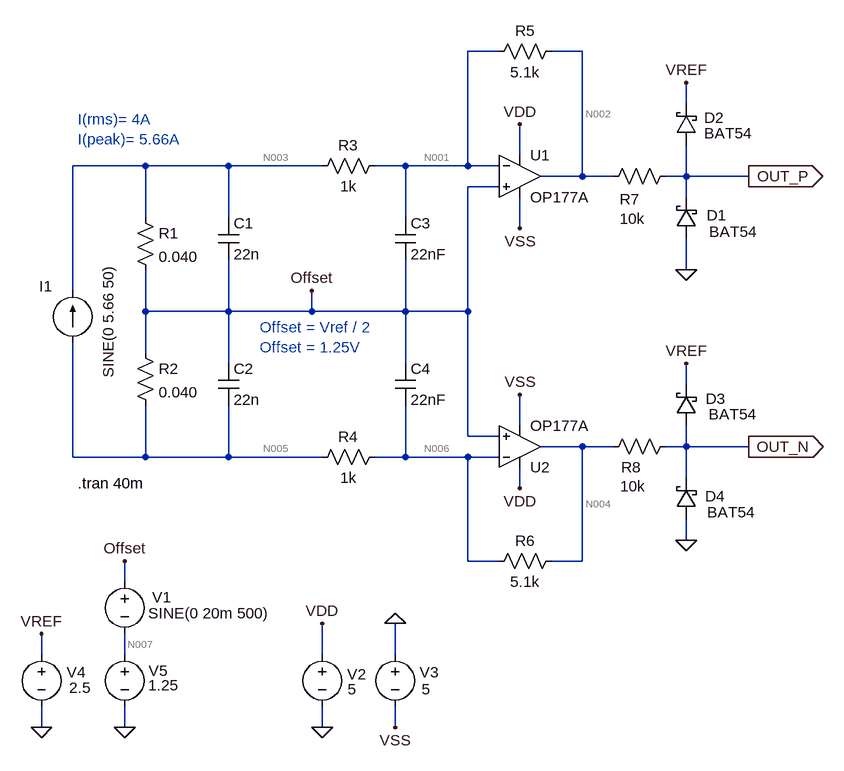
[diagram p0: schematic v1.1.asc]
v1.1.asc, the LTspice schematic file:
Version 4.1
SHEET 1 1828 1004
WIRE 800 -208 752 -208
WIRE 928 -208 880 -208
WIRE 1088 -128 1088 -160
WIRE 832 -48 832 -96
WIRE 256 -32 144 -32
WIRE 384 -32 256 -32
WIRE 528 -32 384 -32
WIRE 656 -32 608 -32
WIRE 752 -32 752 -208
WIRE 752 -32 656 -32
WIRE 800 -32 752 -32
WIRE 928 -16 928 -208
WIRE 928 -16 864 -16
WIRE 976 -16 928 -16
WIRE 1088 -16 1088 -64
WIRE 1088 -16 1056 -16
WIRE 1184 -16 1088 -16
WIRE 800 0 752 0
WIRE 1088 16 1088 -16
WIRE 256 48 256 -32
WIRE 384 48 384 -32
WIRE 656 48 656 -32
WIRE 832 64 832 16
WIRE 1088 128 1088 80
WIRE 144 160 144 -32
WIRE 256 192 256 128
WIRE 384 192 384 112
WIRE 384 192 256 192
WIRE 512 192 512 160
WIRE 512 192 384 192
WIRE 656 192 656 112
WIRE 656 192 512 192
WIRE 752 192 752 0
WIRE 752 192 656 192
WIRE 256 256 256 192
WIRE 384 272 384 192
WIRE 656 272 656 192
WIRE 1088 304 1088 272
WIRE 832 368 832 320
WIRE 752 384 752 192
WIRE 800 384 752 384
WIRE 928 400 864 400
WIRE 976 400 928 400
WIRE 1088 400 1088 368
WIRE 1088 400 1056 400
WIRE 1184 400 1088 400
WIRE 144 416 144 240
WIRE 256 416 256 336
WIRE 256 416 144 416
WIRE 384 416 384 336
WIRE 384 416 256 416
WIRE 528 416 384 416
WIRE 656 416 656 336
WIRE 656 416 608 416
WIRE 752 416 656 416
WIRE 800 416 752 416
WIRE 1088 448 1088 400
WIRE 832 464 832 432
WIRE 1088 544 1088 512
WIRE 752 576 752 416
WIRE 800 576 752 576
WIRE 928 576 928 400
WIRE 928 576 880 576
WIRE 224 608 224 576
WIRE 96 720 96 688
WIRE 224 720 224 688
WIRE 528 720 528 672
WIRE 640 720 640 672
WIRE 96 832 96 800
WIRE 224 832 224 800
WIRE 528 832 528 800
WIRE 640 832 640 800
FLAG 1184 -16 OUT_P
IOPIN 1184 -16 Out
FLAG 1184 400 OUT_N
IOPIN 1184 400 Out
FLAG 528 832 0
FLAG 528 672 VDD
FLAG 832 -96 VDD
FLAG 832 464 VDD
FLAG 640 832 VSS
FLAG 832 64 VSS
FLAG 832 320 VSS
FLAG 1088 544 0
FLAG 1088 128 0
FLAG 96 832 0
FLAG 96 688 VREF
FLAG 224 832 0
FLAG 224 576 Offset
FLAG 512 160 Offset
FLAG 1088 -160 VREF
FLAG 1088 272 VREF
FLAG 640 672 0
SYMBOL current 144 240 R180
WINDOW 0 31 87 Left 2
WINDOW 3 -55 -54 VRight 2
WINDOW 123 0 0 Left 0
WINDOW 39 0 0 Left 0
SYMATTR InstName I1
SYMATTR Value SINE(0 5.66 50)
SYMBOL res 240 32 R0
SYMATTR InstName R1
SYMATTR Value 0.040
SYMBOL res 240 240 R0
SYMATTR InstName R2
SYMATTR Value 0.040
SYMBOL cap 368 48 R0
SYMATTR InstName C1
SYMATTR Value 22n
SYMBOL cap 368 272 R0
SYMATTR InstName C2
SYMATTR Value 22n
SYMBOL res 624 -48 R90
WINDOW 0 0 56 VBottom 2
WINDOW 3 32 56 VTop 2
SYMATTR InstName R3
SYMATTR Value 1k
SYMBOL res 624 400 R90
WINDOW 0 0 56 VBottom 2
WINDOW 3 32 56 VTop 2
SYMATTR InstName R4
SYMATTR Value 1k
SYMBOL cap 640 48 R0
SYMATTR InstName C3
SYMATTR Value 22nF
SYMBOL cap 640 272 R0
SYMATTR InstName C4
SYMATTR Value 22nF
SYMBOL OpAmps\\OP177A 832 -80 R0
SYMATTR InstName U1
SYMBOL OpAmps\\OP177A 832 464 M180
SYMATTR InstName U2
SYMBOL voltage 528 704 R0
WINDOW 123 0 0 Left 0
WINDOW 39 0 0 Left 0
WINDOW 0 38 46 Left 2
WINDOW 3 39 69 Left 2
SYMATTR InstName V2
SYMATTR Value 5
SYMBOL voltage 640 704 R0
WINDOW 123 0 0 Left 0
WINDOW 39 0 0 Left 0
WINDOW 0 38 43 Left 2
WINDOW 3 41 69 Left 2
SYMATTR InstName V3
SYMATTR Value 5
SYMBOL res 896 -224 R90
WINDOW 0 0 56 VBottom 2
WINDOW 3 32 56 VTop 2
SYMATTR InstName R5
SYMATTR Value 5.1k
SYMBOL res 896 560 R90
WINDOW 0 0 56 VBottom 2
WINDOW 3 32 56 VTop 2
SYMATTR InstName R6
SYMATTR Value 5.1k
SYMBOL res 1072 -32 R90
WINDOW 0 67 71 VBottom 2
WINDOW 3 66 67 VTop 2
SYMATTR InstName R7
SYMATTR Value 10k
SYMBOL res 1072 384 R90
WINDOW 0 63 69 VBottom 2
WINDOW 3 61 66 VTop 2
SYMATTR InstName R8
SYMATTR Value 10k
SYMBOL schottky 1104 512 R180
WINDOW 0 -44 36 Left 2
WINDOW 3 -90 11 Left 2
SYMATTR InstName D4
SYMATTR Value BAT54
SYMBOL schottky 1104 80 R180
WINDOW 0 -46 36 Left 2
WINDOW 3 -93 11 Left 2
SYMATTR InstName D1
SYMATTR Value BAT54
SYMBOL voltage 96 704 R0
WINDOW 123 0 0 Left 0
WINDOW 39 0 0 Left 0
WINDOW 0 39 43 Left 2
WINDOW 3 43 67 Left 2
SYMATTR InstName V4
SYMATTR Value 2.5
SYMBOL voltage 224 704 R0
WINDOW 123 0 0 Left 0
WINDOW 39 0 0 Left 0
WINDOW 0 37 41 Left 2
WINDOW 3 36 63 Left 2
SYMATTR InstName V5
SYMATTR Value 1.25
SYMBOL schottky 1104 -64 R180
WINDOW 0 -42 42 Left 2
WINDOW 3 -85 18 Left 2
SYMATTR InstName D2
SYMATTR Value BAT54
SYMBOL schottky 1104 368 R180
WINDOW 0 -45 42 Left 2
WINDOW 3 -92 18 Left 2
SYMATTR InstName D3
SYMATTR Value BAT54
SYMBOL voltage 224 592 R0
WINDOW 123 0 0 Left 0
WINDOW 39 0 0 Left 0
WINDOW 0 42 40 Left 2
WINDOW 3 36 64 Left 2
SYMATTR InstName V1
SYMATTR Value SINE(0 20m 500)
TEXT 152 456 Left 2 !.tran 40m
TEXT 152 -104 Left 2 ;I(rms)= 4A\nI(peak)= 5.66A
TEXT 432 216 Left 2 ;Offset = Vref / 2\nOffset = 1.25V

The netlist it stands for:
* v1.1.asc
I1 N005 N003 SINE(0 5.66 50)
R1 N003 Offset 0.040
R2 Offset N005 0.040
C1 N003 Offset 22n
C2 Offset N005 22n
R3 N001 N003 1k
R4 N006 N005 1k
C3 N001 Offset 22nF
C4 Offset N006 22nF
X§U1 Offset N001 VDD VSS N002 OP177A  ; pins In+ In- V+ V- OUT
X§U2 Offset N006 VDD VSS N004 OP177A  ; pins In+ In- V+ V- OUT
V2 VDD 0 5
V3 0 VSS 5
R5 N002 N001 5.1k
R6 N004 N006 5.1k
R7 OUT_P N002 10k
R8 OUT_N N004 10k
D4 0 OUT_N BAT54
D1 0 OUT_P BAT54
V4 VREF 0 2.5
V5 N007 0 1.25
D2 OUT_P VREF BAT54
D3 OUT_N VREF BAT54
V1 Offset N007 SINE(0 20m 500)
.model D D
.lib standard.dio
.tran 40m
* I(rms)= 4A
* I(peak)= 5.66A
* Offset = Vref / 2
* Offset = 1.25V
.backanno
.end

* Results of the author's LTspice run, read from the files saved beside the schematic
* Operating Point, zero values left out:
*   V(n001) = 1.25 V
*   V(n002) = 1.25 V
*   V(n003) = 1.25 V
*   V(n004) = 1.25 V
*   V(n005) = 1.25 V
*   V(n006) = 1.25 V
*   V(n007) = 1.25 V
*   V(offset) = 1.25 V
*   V(out_n) = 1.25 V
*   V(out_p) = 1.25 V
*   V(vdd) = 5 V
*   V(vref) = 2.5 V
*   V(vss) = -5 V
*   I(D1) = -100 nA
*   I(D2) = -100 nA
*   I(D3) = -100 nA
*   I(D4) = -100 nA
*   I(R1) = 29.82 nA
*   I(R2) = -29.82 nA
*   I(R3) = 29.82 nA
*   I(R4) = 29.82 nA
*   I(R5) = 30.78 nA
*   I(R6) = 30.78 nA
*   I(V1) = 57.14 nA
*   I(V2) = -2.3 mA
*   I(V3) = -2.3 mA
*   I(V4) = -200 nA
*   I(V5) = 57.14 nA
*   Ix(u1:1) = 1.252 nA
*   Ix(u1:2) = 960.1 pA
*   Ix(u1:3) = 1.15 mA
*   Ix(u1:4) = -1.15 mA
*   Ix(u1:5) = -30.78 nA
*   Ix(u2:1) = 1.252 nA
*   Ix(u2:2) = 960.1 pA
*   Ix(u2:3) = 1.15 mA
*   Ix(u2:4) = -1.15 mA
*   Ix(u2:5) = -30.78 nA
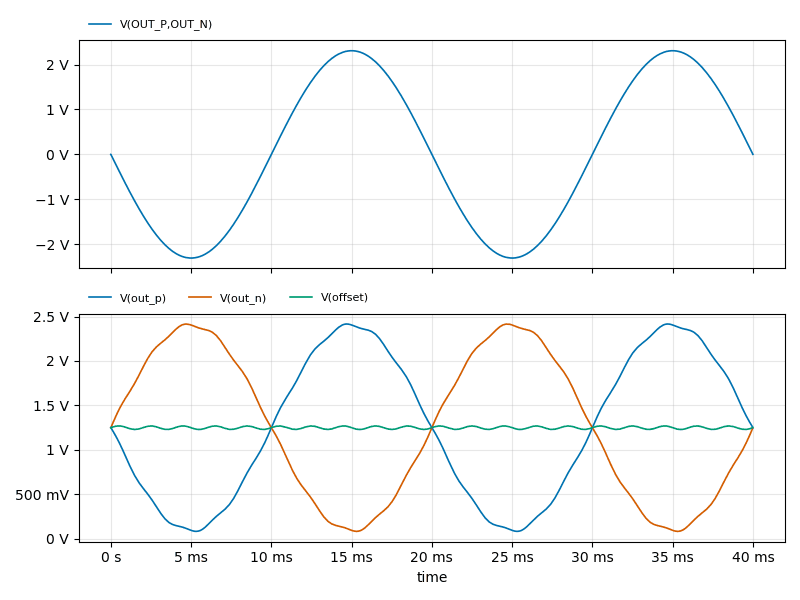
[diagram p1: Transient Analysis of v1.1.asc, plotted from the saved traces]
* Transient Analysis, 1 run:
*   V(OUT_P,OUT_N): min -2.309 V, max 2.309 V, average 9.502 µV, rms 1.633 V, last 1.463 mV
*   V(out_p): min 84.56 mV, max 2.416 V, average 1.25 V, rms 1.493 V, last 1.251 V
*   V(out_n): min 84.55 mV, max 2.416 V, average 1.25 V, rms 1.493 V, last 1.249 V
*   V(offset): min 1.23 V, max 1.27 V, average 1.25 V, rms 1.25 V, last 1.25 V